# EAGLE schematic grbl-shield-easydriver (EAGLE 6.5.0)
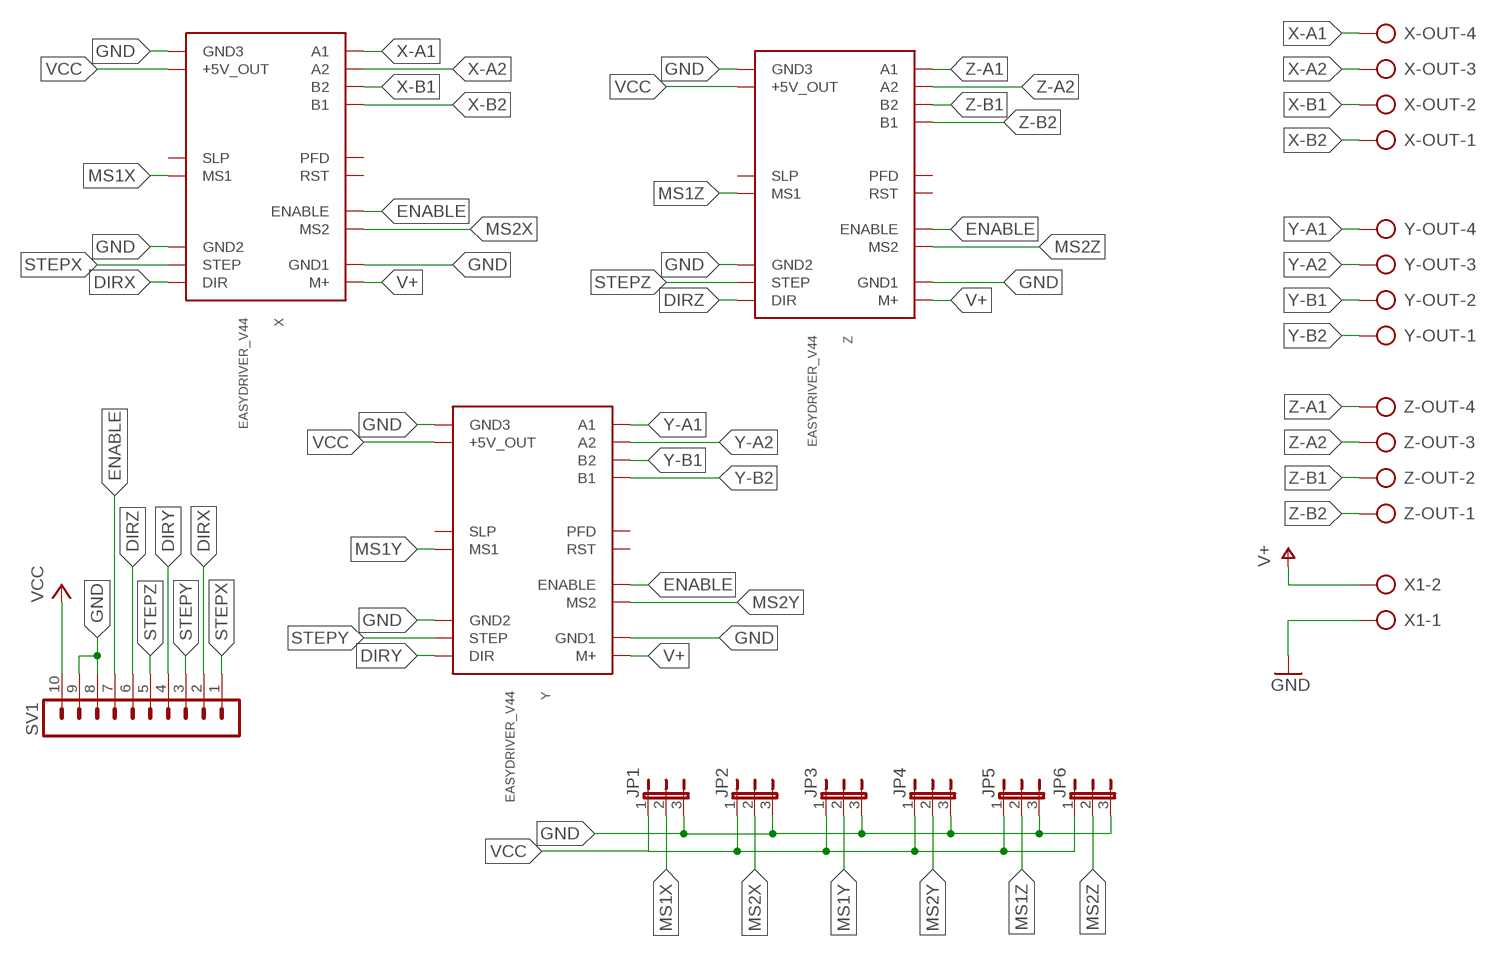
[diagram p0: schematic, sheet 1]

## Parts
JP1  JP2E  [JP2]
JP2  JP2E  [JP2]
JP3  JP2E  [JP2]
JP4  JP2E  [JP2]
JP5  JP2E  [JP2]
JP6  JP2E  [JP2]
SV1  MA10-1  [MA10-1]
X  EASYDRIVER_V44  [EASYDRIVER_V44]
X1  AK500/2  [AK500/2]
X-OUT  AK500/4  [AK500/4]
Y  EASYDRIVER_V44  [EASYDRIVER_V44]
Y-OUT  AK500/4  [AK500/4]
Z  EASYDRIVER_V44  [EASYDRIVER_V44]
Z-OUT  AK500/4  [AK500/4]

## Nets
DIRX: SV1.2 X.DIR
DIRY: SV1.4 Y.DIR
DIRZ: SV1.6 Z.DIR
ENABLE: SV1.7 X.ENABLE Y.ENABLE Z.ENABLE
GND: JP1.3 JP2.3 JP3.3 JP4.3 JP5.3 JP6.3 SV1.8 SV1.9 X1.1 X.GND1 X.GND2 X.GND3 Y.GND1 Y.GND2 Y.GND3 Z.GND1 Z.GND2 Z.GND3
MS1X: JP1.2 X.MS1
MS1Y: JP3.2 Y.MS1
MS1Z: JP5.2 Z.MS1
MS2X: JP2.2 X.MS2
MS2Y: JP4.2 Y.MS2
MS2Z: JP6.2 Z.MS2
STEPX: SV1.1 X.STEP
STEPY: SV1.3 Y.STEP
STEPZ: SV1.5 Z.STEP
V+: X1.2 X.M+ Y.M+ Z.M+
VCC: JP1.1 JP2.1 JP3.1 JP4.1 JP5.1 JP6.1 SV1.10 X.P$11(+5V_OUT) Y.P$11(+5V_OUT) Z.P$11(+5V_OUT)
X-A1: X-OUT.4 X.A1
X-A2: X-OUT.3 X.A2
X-B1: X-OUT.2 X.B2
X-B2: X-OUT.1 X.B1
Y-A1: Y-OUT.4 Y.A1
Y-A2: Y-OUT.3 Y.A2
Y-B1: Y-OUT.2 Y.B2
Y-B2: Y-OUT.1 Y.B1
Z-A1: Z-OUT.4 Z.A1
Z-A2: Z-OUT.3 Z.A2
Z-B1: Z-OUT.2 Z.B2
Z-B2: Z-OUT.1 Z.B1
Unconnected: X.PFD X.RST X.SLEEP(SLP) Y.PFD Y.RST Y.SLEEP(SLP) Z.PFD Z.RST Z.SLEEP(SLP)

## Library data of the parts
JP1-JP6 = jumper:JP2E: JUMPER
SV1 = con-lstb:MA10-1: PIN HEADER; OC_FARNELL: unknown; OC_NEWARK: unknown
X Y Z = EasyDriver:EASYDRIVER_V44: EasyDriver version 4.4 - http://www.schmalzhaus.com/EasyDriver
X1 = con-ptr500:AK500/2: CONNECTOR; OC_FARNELL: unknown; OC_NEWARK: unknown
X-OUT Y-OUT Z-OUT = con-ptr500:AK500/4: CONNECTOR; OC_FARNELL: unknown; OC_NEWARK: unknown